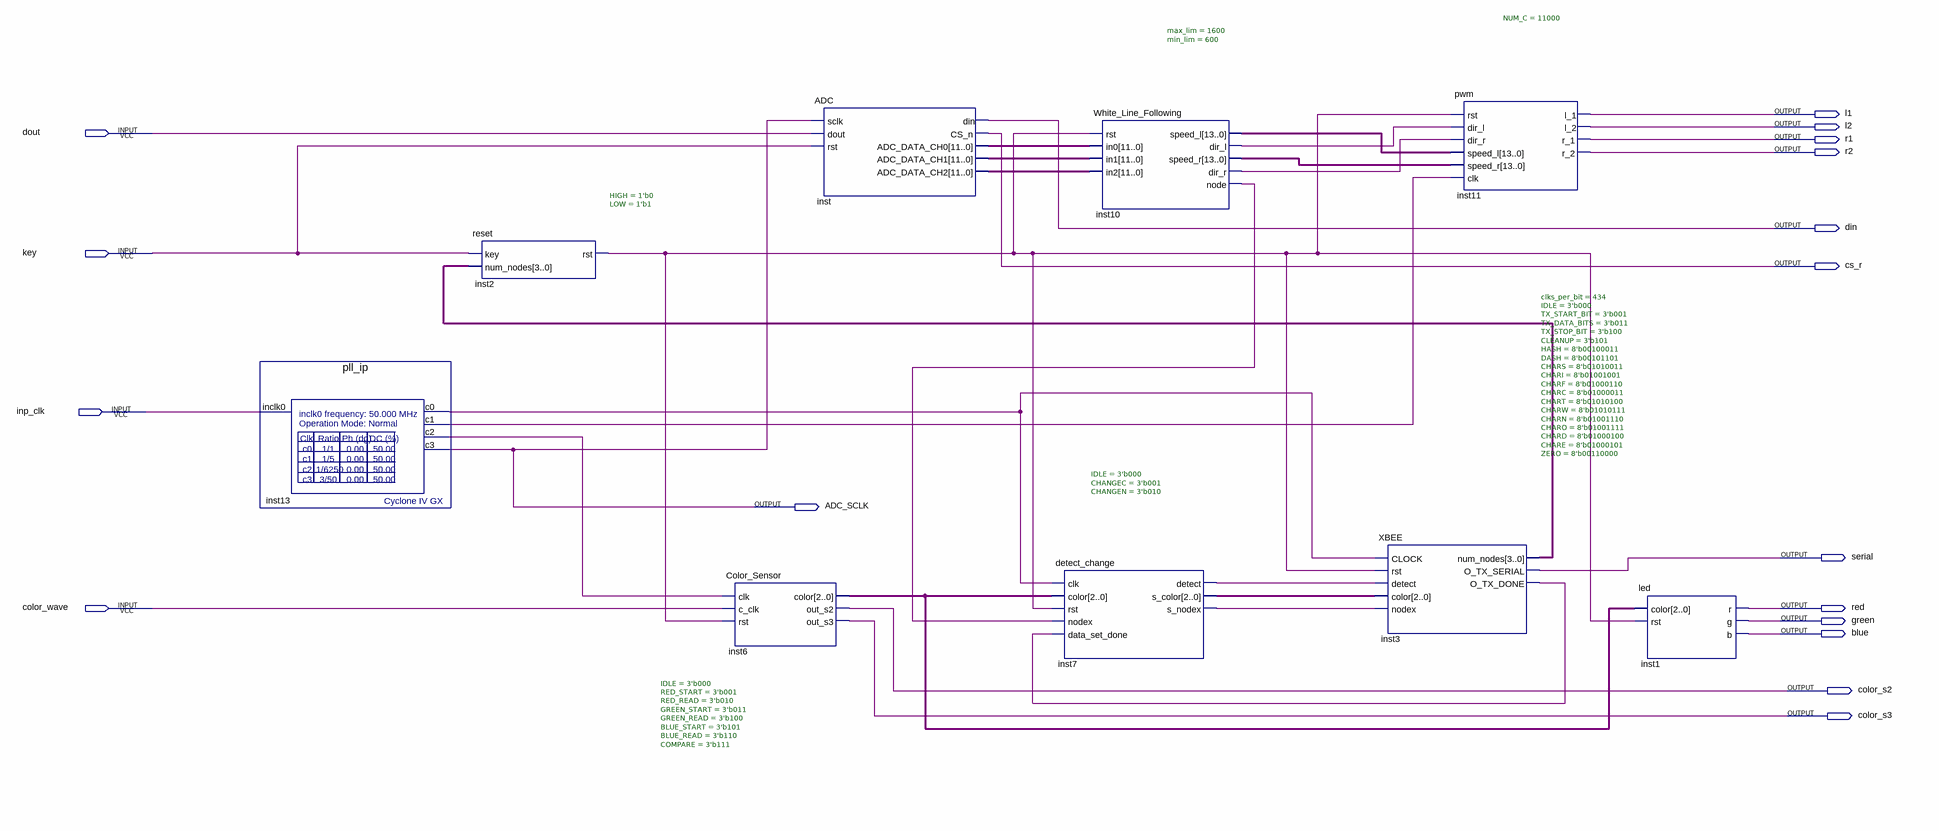
[diagram p0: schematic sheet]
// Quartus schematic full_task.bdf as structural Verilog: 9 symbols, 17 pins
module full_task (
  input  dout,
  input  key,
  input  inp_clk,
  input  color_wave,
  output l1,
  output l2,
  output r1,
  output r2,
  output din,
  output cs_r,
  output ADC_SCLK,
  output serial,
  output red,
  output green,
  output blue,
  output color_s2,
  output color_s3
);

  wire inst2_rst, inst3_o_tx_done, inst7_detect, inst7_s_nodex, inst10_dir_l, inst10_dir_r, inst10_node,
       inst13_c0, inst13_c1, inst13_c2;
  wire [2:0] inst6_color, inst7_s_color;
  wire [3:0] inst3_num_nodes;
  wire [11:0] inst_adc_data_ch0, inst_adc_data_ch1, inst_adc_data_ch2;
  wire [13:0] inst10_speed_l, inst10_speed_r;

  pll_ip inst13 (.inclk0(inp_clk), .c0(inst13_c0), .c1(inst13_c1), .c2(inst13_c2), .c3(ADC_SCLK));
  reset #(.HIGH(1'b0), .LOW(1'b1)) inst2 (.key(key), .num_nodes(inst3_num_nodes), .rst(inst2_rst));
  Color_Sensor #(.IDLE(3'b000), .RED_START(3'b001), .RED_READ(3'b010), .GREEN_START(3'b011), .GREEN_READ(3'b100), .BLUE_START(3'b101), .BLUE_READ(3'b110), .COMPARE(3'b111)) inst6 (
    .clk(inst13_c2), .c_clk(color_wave), .rst(inst2_rst), .color(inst6_color), .out_s2(color_s2),
    .out_s3(color_s3));
  ADC inst (
    .sclk(ADC_SCLK), .dout(dout), .rst(key), .din(din), .CS_n(cs_r), .ADC_DATA_CH0(inst_adc_data_ch0),
    .ADC_DATA_CH1(inst_adc_data_ch1), .ADC_DATA_CH2(inst_adc_data_ch2));
  detect_change #(.IDLE(3'b000), .CHANGEC(3'b001), .CHANGEN(3'b010)) inst7 (
    .clk(inst13_c0), .color(inst6_color), .rst(inst2_rst), .nodex(inst10_node),
    .data_set_done(inst3_o_tx_done), .detect(inst7_detect), .s_color(inst7_s_color), .s_nodex(inst7_s_nodex));
  White_Line_Following #(.max_lim(1600), .min_lim(600)) inst10 (
    .rst(inst2_rst), .in0(inst_adc_data_ch0), .in1(inst_adc_data_ch1), .in2(inst_adc_data_ch2),
    .speed_l(inst10_speed_l), .dir_l(inst10_dir_l), .speed_r(inst10_speed_r), .dir_r(inst10_dir_r),
    .node(inst10_node));
  XBEE #(.clks_per_bit(434), .IDLE(3'b000), .TX_START_BIT(3'b001), .TX_DATA_BITS(3'b011), .TX_STOP_BIT(3'b100), .CLEANUP(3'b101), .HASH(8'b00100011), .DASH(8'b00101101), .CHARS(8'b01010011), .CHARI(8'b01001001), .CHARF(8'b01000110), .CHARC(8'b01000011), .CHART(8'b01010100), .CHARW(8'b01010111), .CHARN(8'b01001110), .CHARO(8'b01001111), .CHARD(8'b01000100), .CHARE(8'b01000101), .ZERO(8'b00110000)) inst3 (
    .CLOCK(inst13_c0), .rst(inst2_rst), .detect(inst7_detect), .color(inst7_s_color), .nodex(inst7_s_nodex),
    .num_nodes(inst3_num_nodes), .O_TX_SERIAL(serial), .O_TX_DONE(inst3_o_tx_done));
  pwm #(.NUM_C(11000)) inst11 (
    .rst(inst2_rst), .dir_l(inst10_dir_l), .dir_r(inst10_dir_r), .speed_l(inst10_speed_l),
    .speed_r(inst10_speed_r), .clk(inst13_c1), .l_1(l1), .l_2(l2), .r_1(r1), .r_2(r2));
  led inst1 (.color(inst6_color), .rst(inst2_rst), .r(red), .g(green), .b(blue));
endmodule
